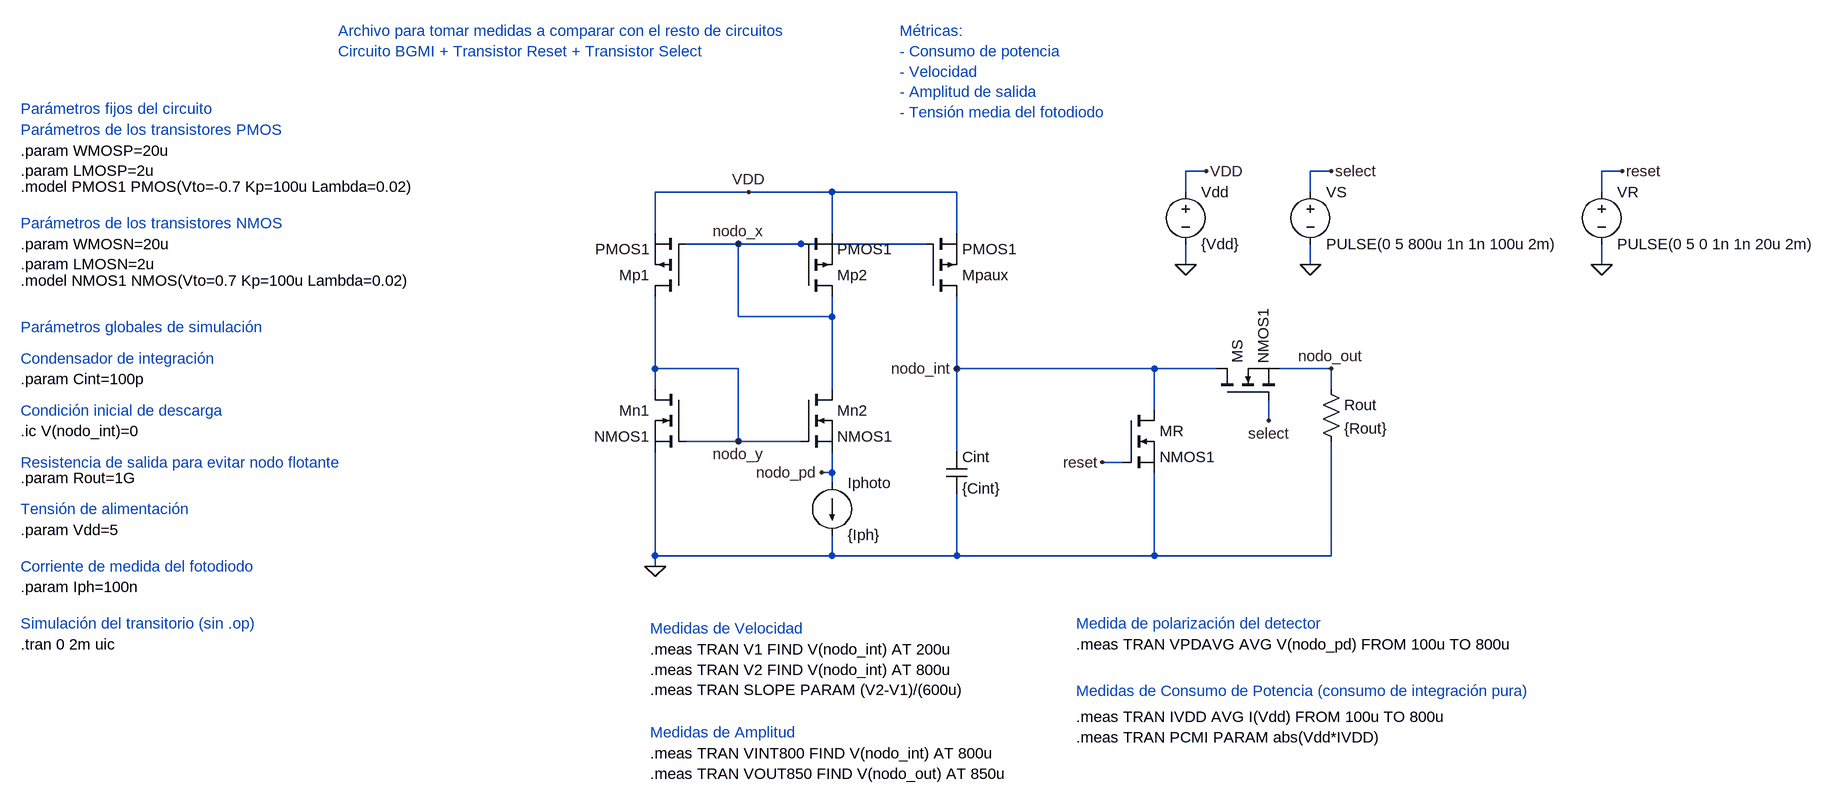
[diagram p0: schematic CMI_Comp.asc]
CMI_Comp.asc, the LTspice schematic file:
Version 4.1
SHEET 1 1940 680
WIRE 848 -528 816 -528
WIRE 1040 -528 1008 -528
WIRE 1488 -528 1456 -528
WIRE 144 -496 0 -496
WIRE 272 -496 144 -496
WIRE 464 -496 272 -496
WIRE 816 -496 816 -528
WIRE 1008 -496 1008 -528
WIRE 1456 -496 1456 -528
WIRE 0 -432 0 -496
WIRE 272 -432 272 -496
WIRE 464 -432 464 -496
WIRE 128 -416 48 -416
WIRE 224 -416 128 -416
WIRE 416 -416 224 -416
WIRE 816 -384 816 -416
WIRE 1008 -384 1008 -416
WIRE 1456 -384 1456 -416
WIRE 128 -304 128 -416
WIRE 272 -304 272 -336
WIRE 272 -304 128 -304
WIRE 0 -224 0 -336
WIRE 128 -224 0 -224
WIRE 464 -224 464 -336
WIRE 768 -224 464 -224
WIRE 864 -224 768 -224
WIRE 1040 -224 960 -224
WIRE 0 -192 0 -224
WIRE 272 -192 272 -304
WIRE 1040 -192 1040 -224
WIRE 768 -160 768 -224
WIRE 944 -144 944 -176
WIRE 128 -112 128 -224
WIRE 128 -112 48 -112
WIRE 224 -112 128 -112
WIRE 464 -96 464 -224
WIRE 720 -80 688 -80
WIRE 272 -64 272 -96
WIRE 272 -64 256 -64
WIRE 272 -48 272 -64
WIRE 0 64 0 -96
WIRE 272 64 272 32
WIRE 272 64 0 64
WIRE 464 64 464 -32
WIRE 464 64 272 64
WIRE 768 64 768 -64
WIRE 768 64 464 64
WIRE 1040 64 1040 -112
WIRE 1040 64 768 64
WIRE 0 80 0 64
FLAG 144 -496 VDD
FLAG 0 80 0
FLAG 256 -64 nodo_pd
FLAG 128 -416 nodo_x
FLAG 128 -112 nodo_y
FLAG 816 -384 0
FLAG 848 -528 VDD
FLAG 464 -224 nodo_int
FLAG 1008 -384 0
FLAG 1040 -528 select
FLAG 944 -144 select
FLAG 1040 -224 nodo_out
FLAG 688 -80 reset
FLAG 1456 -384 0
FLAG 1488 -528 reset
SYMBOL current 272 -48 R0
SYMATTR InstName Iphoto
SYMATTR Value {Iph}
SYMBOL nmos 48 -192 M0
SYMATTR InstName Mn1
SYMATTR Value NMOS1
SYMATTR SpiceLine L={LMOSN} W={WMOSN}
SYMBOL nmos 224 -192 R0
SYMATTR InstName Mn2
SYMATTR Value NMOS1
SYMATTR SpiceLine L={LMOSN} W={WMOSN}
SYMBOL pmos 48 -336 R180
SYMATTR InstName Mp1
SYMATTR Value PMOS1
SYMATTR SpiceLine L={LMOSP} W={WMOSP}
SYMBOL pmos 224 -336 M180
SYMATTR InstName Mp2
SYMATTR Value PMOS1
SYMATTR SpiceLine L={LMOSP} W={WMOSP}
SYMBOL voltage 816 -512 R0
SYMATTR InstName Vdd
SYMATTR Value {Vdd}
SYMBOL pmos 416 -336 M180
SYMATTR InstName Mpaux
SYMATTR Value PMOS1
SYMATTR SpiceLine L={LMOSP} W={WMOSP}
SYMBOL cap 448 -96 R0
SYMATTR InstName Cint
SYMATTR Value {Cint}
SYMBOL nmos 864 -176 R270
SYMATTR InstName MS
SYMATTR Value NMOS1
SYMATTR SpiceLine L={LMOSN} W={WMOSN}
SYMBOL voltage 1008 -512 R0
SYMATTR InstName VS
SYMATTR Value PULSE(0 5 800u 1n 1n 100u 2m)
SYMBOL res 1024 -208 R0
SYMATTR InstName Rout
SYMATTR Value {Rout}
SYMBOL nmos 720 -160 R0
SYMATTR InstName MR
SYMATTR Value NMOS1
SYMATTR SpiceLine L={LMOSN} W={WMOSN}
SYMBOL voltage 1456 -512 R0
SYMATTR InstName VR
SYMATTR Value PULSE(0 5 0 1n 1n 20u 2m)
TEXT -976 80 Left 2 ;Corriente de medida del fotodiodo
TEXT -976 112 Left 2 !.param Iph=100n
TEXT -976 -560 Left 2 !.param WMOSP=20u\n.param LMOSP=2u
TEXT -976 -592 Left 2 ;Parámetros de los transistores PMOS
TEXT -976 -504 Left 2 !.model PMOS1 PMOS(Vto=-0.7 Kp=100u Lambda=0.02)
TEXT -976 -416 Left 2 !.param WMOSN=20u\n.param LMOSN=2u
TEXT -976 -448 Left 2 ;Parámetros de los transistores NMOS
TEXT -976 -360 Left 2 !.model NMOS1 NMOS(Vto=0.7 Kp=100u Lambda=0.02)
TEXT -976 -8 Left 2 ;Tensión de alimentación
TEXT -976 24 Left 2 !.param Vdd=5
TEXT -976 200 Left 2 !.tran 0 2m uic
TEXT -976 168 Left 2 ;Simulación del transitorio (sin .op)
TEXT -976 -240 Left 2 ;Condensador de integración
TEXT -976 -208 Left 2 !.param Cint=100p
TEXT -976 -160 Left 2 ;Condición inicial de descarga
TEXT -976 -128 Left 2 !.ic V(nodo_int)=0
TEXT -976 -80 Left 2 ;Resistencia de salida para evitar nodo flotante
TEXT -976 -56 Left 2 !.param Rout=1G
TEXT -488 -744 Left 2 ;Archivo para tomar medidas a comparar con el resto de circuitos\nCircuito BGMI + Transistor Reset + Transistor Select
TEXT 376 -744 Left 2 ;Métricas:\n- Consumo de potencia\n- Velocidad\n- Amplitud de salida\n- Tensión media del fotodiodo
TEXT -976 -624 Left 2 ;Parámetros fijos del circuito
TEXT -976 -288 Left 2 ;Parámetros globales de simulación
TEXT -8 176 Left 2 ;Medidas de Velocidad
TEXT -8 208 Left 2 !.meas TRAN V1 FIND V(nodo_int) AT 200u\n.meas TRAN V2 FIND V(nodo_int) AT 800u\n.meas TRAN SLOPE PARAM (V2-V1)/(600u)
TEXT -8 336 Left 2 ;Medidas de Amplitud
TEXT -8 368 Left 2 !.meas TRAN VINT800 FIND V(nodo_int) AT 800u\n.meas TRAN VOUT850 FIND V(nodo_out) AT 850u
TEXT 648 168 Left 2 ;Medida de polarización del detector
TEXT 648 200 Left 2 !.meas TRAN VPDAVG AVG V(nodo_pd) FROM 100u TO 800u
TEXT 648 272 Left 2 ;Medidas de Consumo de Potencia (consumo de integración pura)
TEXT 648 312 Left 2 !.meas TRAN IVDD AVG I(Vdd) FROM 100u TO 800u\n.meas TRAN PCMI PARAM abs(Vdd*IVDD)

The netlist it stands for:
* CMI_Comp.asc
Iphoto nodo_pd 0 {Iph}
Mn1 nodo_y nodo_y 0 0 NMOS1 L={LMOSN} W={WMOSN}
Mn2 nodo_x nodo_y nodo_pd nodo_pd NMOS1 L={LMOSN} W={WMOSN}
Mp1 nodo_y nodo_x VDD VDD PMOS1 L={LMOSP} W={WMOSP}
Mp2 nodo_x nodo_x VDD VDD PMOS1 L={LMOSP} W={WMOSP}
Vdd VDD 0 {Vdd}
Mpaux nodo_int nodo_x VDD VDD PMOS1 L={LMOSP} W={WMOSP}
Cint nodo_int 0 {Cint}
MS nodo_int select nodo_out nodo_out NMOS1 L={LMOSN} W={WMOSN}
VS select 0 PULSE(0 5 800u 1n 1n 100u 2m)
Rout nodo_out 0 {Rout}
MR nodo_int reset 0 0 NMOS1 L={LMOSN} W={WMOSN}
VR reset 0 PULSE(0 5 0 1n 1n 20u 2m)
.model NMOS NMOS
.model PMOS PMOS
.lib standard.mos
* Corriente de medida del fotodiodo
.param Iph=100n
.param WMOSP=20u
.param LMOSP=2u
* Parámetros de los transistores PMOS
.model PMOS1 PMOS(Vto=-0.7 Kp=100u Lambda=0.02)
.param WMOSN=20u
.param LMOSN=2u
* Parámetros de los transistores NMOS
.model NMOS1 NMOS(Vto=0.7 Kp=100u Lambda=0.02)
* Tensión de alimentación
.param Vdd=5
.tran 0 2m uic
* Simulación del transitorio (sin .op)
* Condensador de integración
.param Cint=100p
* Condición inicial de descarga
.ic V(nodo_int)=0
* Resistencia de salida para evitar nodo flotante
.param Rout=1G
* Archivo para tomar medidas a comparar con el resto de circuitos
* Circuito BGMI + Transistor Reset + Transistor Select
* Métricas:
* - Consumo de potencia
* - Velocidad
* - Amplitud de salida
* - Tensión media del fotodiodo
* Parámetros fijos del circuito
* Parámetros globales de simulación
* Medidas de Velocidad
.meas TRAN V1 FIND V(nodo_int) AT 200u
.meas TRAN V2 FIND V(nodo_int) AT 800u
.meas TRAN SLOPE PARAM (V2-V1)/(600u)
* Medidas de Amplitud
.meas TRAN VINT800 FIND V(nodo_int) AT 800u
.meas TRAN VOUT850 FIND V(nodo_out) AT 850u
* Medida de polarización del detector
.meas TRAN VPDAVG AVG V(nodo_pd) FROM 100u TO 800u
* Medidas de Consumo de Potencia (consumo de integración pura)
.meas TRAN IVDD AVG I(Vdd) FROM 100u TO 800u
.meas TRAN PCMI PARAM abs(Vdd*IVDD)
.backanno
.end

* Results of the author's LTspice run, read from the files saved beside the schematic
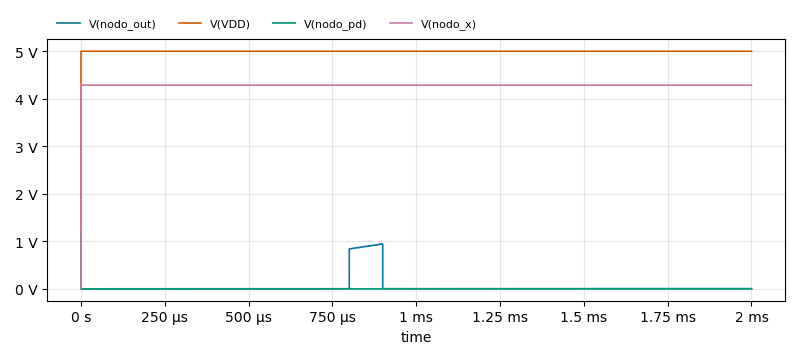
[diagram p1: Transient Analysis of CMI_Comp.asc, plotted from the saved traces]
* Transient Analysis, 1 run:
*   V(nodo_out): min 0 V, max 945.3 mV, average 46.64 mV, rms 199.7 mV, last 4.212 mV
*   V(VDD): min 0 V, max 5 V, average 5 V, rms 5 V, last 5 V
*   V(nodo_pd): min 0 V, max 1.236 V, average 956.6 µV, rms 956.6 µV, last 956.6 µV
*   V(nodo_x): min 0 V, max 4.287 V, average 4.286 V, rms 4.286 V, last 4.286 V
* From the log:
*   v1: V(nodo_int) =0.194903791548 at 0.0002
*   v2: V(nodo_int) =0.8395165205 at 0.0008
*   slope: (V2-V1)/(600u)=1074.35454825
*   vint800: V(nodo_int) =0.8395165205 at 0.0008
*   vout850: V(nodo_out) =0.892457552891 at 0.00085
*   vpdavg: AVG(V(nodo_pd) )=0.000956645002587 FROM 0.0001 TO 0.0008
*   ivdd: AVG(I(Vdd) )=-3.14593180759e-07 FROM 0.0001 TO 0.0008
*   pcmi: abs(Vdd*IVDD)=1.57296590379e-06